# Altium schematic sheet pasta_razer_panthera_ps3_ps4.SchDoc
size Letter
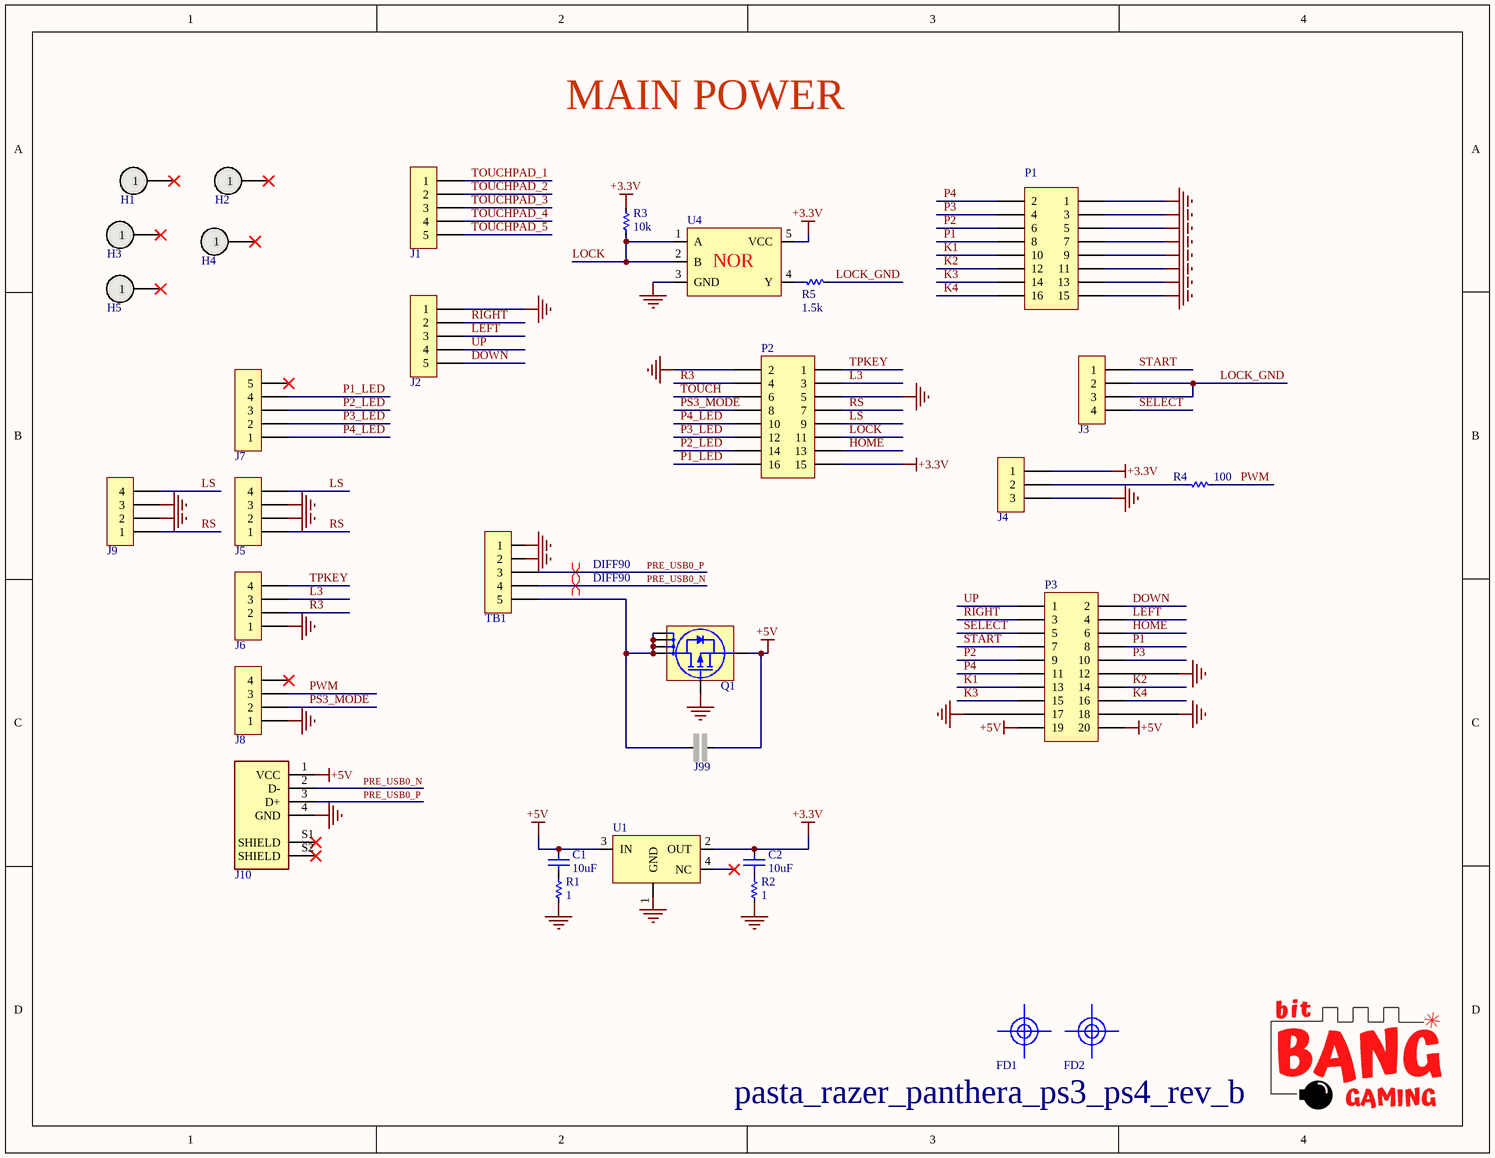
[diagram p0: pasta_razer_panthera_ps3_ps4.SchDoc]

## Parts
C1  10uF  [C1206]
C2  10uF  [C1206]
FD1  FIDUCIAL 60MIL CIRCLE  [FIDUCIAL-SQUARE-0.060]  (value not drawn)
FD2  FIDUCIAL 60MIL CIRCLE  [FIDUCIAL-SQUARE-0.060]  (value not drawn)
H1  M3  [STANDOFF-KEYSTONE-24882]  (value not drawn)
H2  M3  [STANDOFF-KEYSTONE-24882]  (value not drawn)
H3  M3  [STANDOFF-KEYSTONE-24882]  (value not drawn)
H4  M3  [STANDOFF-KEYSTONE-24882]  (value not drawn)
H5  M3  [STANDOFF-KEYSTONE-24882]  (value not drawn)
J1  B5B-XH-A(LF)(SN)  [CONN-JST-B5B-XH-A(LF)(SN)]  (value not drawn)
J2  B5B-XH-A(LF)(SN)  [CONN-JST-B5B-XH-A(LF)(SN)]  (value not drawn)
J3  B4B-XH-A(LF)(SN)  [CONN-JST-B4B-XH-A(LF)(SN)]  (value not drawn)
J4  B3B-XH-A(LF)(SN)  [CONN-JST-B3B-XH-A(LF)(SN)]  (value not drawn)
J5  S4B-PH-K-S(LF)(SN)  [CONN-JST-S4B-PH-K-S(LF)(SN)]  (value not drawn)
J6  S4B-PH-K-S(LF)(SN)  [CONN-JST-S4B-PH-K-S(LF)(SN)]  (value not drawn)
J7  S5B-PH-K-S(LF)(SN)  [CONN-JST-S5B-PH-K-S(LF)(SN)]  (value not drawn)
J8  S4B-PH-K-S(LF)(SN)  [CONN-JST-S4B-PH-K-S(LF)(SN)]  (value not drawn)
J9  M20-9990446  [CONN-1X4-HEADER-0.100-SIL]  (value not drawn)
J10  USB-A-S-S-W-TH  [CONN-USB-TYPE-A-FEMALE-RA]  (value not drawn)
J99  60 MIL SOLDER SHORT BRDIGE  [SOLDER-SHORT]  (value not drawn)  (no BOM)
P1  PH2-16-UA  [CONN-THRU-2X8-HEADER-0.100]  (value not drawn)
P2  PH2-16-UA  [CONN-THRU-2X8-HEADER-0.100]  (value not drawn)
P3  PH2-20-UA  [CONN-THRU-2X10-HEADER-0.100]  (value not drawn)
Q1  DMP3056LDM-7  [IC-SOT23-6]  (value not drawn)
R1  1  [r0603]
R2  1  [r0603]
R3  10k  [r0603]
R4  100  [r0603]
R5  1.5k  [r0603]
TB1  OSTVN05A150  [TB-5PIN-OST-OSTVN05A150]  (value not drawn)
U1  NCP1117LPST33T3G  [IC-SOT-223]  (value not drawn)
U4  SN74AHC1G02DBVT  [IC-SOT23-5]  (value not drawn)

## Nets
+3.3V: C2.2 J4.1 P2.15 R3.2 U1.2(OUT) U4.5(VCC)
+5V: C1.2 J10.1(VCC) J99.1 P3.19 P3.20 Q1.4(S) U1.3(IN)
GND: J2.1 J4.3 J5.2 J5.3 J6.1 J8.1 J9.2 J9.3 J10.4(GND) P1.1 P1.3 P1.5 P1.7 P1.9 P1.11 P1.13 P1.15 P2.2 P2.5 P3.12 P3.17 P3.18 Q1.3(G) R1.2 R2.2 TB1.1 TB1.2 U1.1(GND) U4.3(GND)
DOWN: J2.5 P3.2
HOME: P2.13 P3.6
K1: P1.10 P3.13
K2: P1.12 P3.14
K3: P1.14 P3.15
K4: P1.16 P3.16
L3: J6.3 P2.3
LEFT: J2.3 P3.4
LOCK: P2.11 R3.1 U4.1(A) U4.2(B)
LOCK_GND: J3.2 J3.3 R5.2
LS: J5.4 J9.4 P2.9
P1: P1.8 P3.8
P1_LED: J7.4 P2.16
P2: P1.6 P3.9
P2_LED: J7.3 P2.14
P3: P1.4 P3.10
P3_LED: J7.2 P2.12
P4: P1.2 P3.11
P4_LED: J7.1 P2.10
PRE_USB0_N: J10.2(D-) TB1.4
PRE_USB0_P: J10.3(D+) TB1.3
PS3_MODE: J8.2 P2.8
PWM: J8.3 R4.2
R3: J6.2 P2.4
RIGHT: J2.2 P3.3
RS: J5.1 J9.1 P2.7
SELECT: J3.4 P3.5
START: J3.1 P3.7
TOUCH: P2.6
TOUCHPAD_1: J1.1
TOUCHPAD_2: J1.2
TOUCHPAD_3: J1.3
TOUCHPAD_4: J1.4
TOUCHPAD_5: J1.5
TPKEY: J6.4 P2.1
UP: J2.4 P3.1
NetC1_1: C1.1 R1.1
NetC2_1: C2.1 R2.1
NetJ4_2: J4.2 R4.1
NetJ99_2: J99.2 Q1.1(D) Q1.2(D) Q1.5(D) Q1.6(D) TB1.5
NetR5_1: R5.1 U4.4(Y)

Not connected (* = marked no-connect by the designer): H1 1*; H2 1*; H3 1*; H4 1*; H5 1*; J7 5*; J8 4*; J10 S1(SHIELD)* S2(SHIELD)*; U1 4(NC)*

## Layout directives
differential pair; net class DIFF90: PRE_USB0_N, PRE_USB0_P

## Notes on the sheet
- MAIN POWER
- pasta_razer_panthera_ps3_ps4_rev_b
- (in symbol SN74AHC1G02DBVT) NOR

## Library data of the parts
C1 C2 = CL31B106KAHNFNE: CAP CER 10UF 25V X7R 1206; Manufacturer: Samsung Electro-Mechanics; Manufacturer Part Number: CL31B106KAHNFNE; Package / Case: 1206; Footprint Type: SMT
H1-H5 = 24882: ROUND STANDOFF M3 STEEL 3MM"; Manufacturer: Keystone Electronics; Manufacturer Part Number: 24882; Package / Case: M3; Footprint Type: SMT
J1 J2 = B5B-XH-A(LF)(SN): CONN HEADER VERT 5POS 2.5MM; Manufacturer: JST Sales America Inc.; Manufacturer Part Number: B5B-XH-A(LF)(SN); Package / Case: 5POS; Footprint Type: THT
J3 = B4B-XH-A(LF)(SN): CONN HEADER VERT 4POS 2.5MM; Manufacturer: JST Sales America Inc.; Manufacturer Part Number: B4B-XH-A(LF)(SN); Package / Case: 4POS; Footprint Type: THT
J4 = B3B-XH-A(LF)(SN): CONN HEADER VERT 3POS 2.5MM; Manufacturer: JST Sales America Inc.; Manufacturer Part Number: B3B-XH-A(LF)(SN); Package / Case: 3POS; Footprint Type: THT
J5 J6 J8 = S4B-PH-K-S(LF)(SN): CONN HEADER R/A 4POS 2MM; Manufacturer: JST Sales America Inc.; Manufacturer Part Number: S4B-PH-K-S(LF)(SN); Package / Case: 4POS; Footprint Type: THT
J7 = S5B-PH-K-S(LF)(SN): CONN HEADER R/A 5POS 2MM; Manufacturer: JST Sales America Inc.; Manufacturer Part Number: S5B-PH-K-S(LF)(SN); Package / Case: 5POS; Footprint Type: THT
J9 = M20-9990446: CONN HEADER VERT 4POS 2.54MM; Manufacturer: Harwin Inc.; Manufacturer Part Number: M20-9990446; Package / Case: 4POS; Footprint Type: THT
J10 = USB-A-S-S-W-TH: CONN RCPT USB2.0 TYPEA 4POS R/A; Manufacturer: Samtec; Footprint Type: THT; Manufacturer Part Number: USB-A-S-S-W-TH; Package / Case: USB TYPE A FEMALE
J99 = SOLDER BRIDGE
P1 P2 = PH2-16-UA: CONN HEADER VERT 16POS 2.54MM; Adam Tech: Manufacturer; THT: Footprint Type; Manufacturer Part Number: PH2-16-UA; Package / Case: 16POS
P3 = PH2-20-UA: CONN HEADER VERT 20POS 2.54MM; Manufacturer: Adam Tech; Manufacturer Part Number: PH2-20-UA; Package / Case: 20POS; Footprint Type: THT
Q1 = DMP3056LDM-7: MOSFET P-CH 30V 4.3A SOT-26; Manufacturer: Diodes Incorporated; Manufacturer Part Number: DMP3056LDM-7; Package / Case: SOT-23-6; Footprint Type: SMT
R1 R2 = CRCW06031R00FKEA: RES SMD 1 OHM 1% 1/10W 0603; Manufacturer: Vishay Dale; Manufacturer Part Number: CRCW06031R00FKEA; Footprint Type: SMT; Package / Case: 0603
R3 = CRCW060310K0FKEA: RES SMD 10K OHM 1% 1/10W 0603; Manufacturer: Vishay Dale; Manufacturer Part Number: CRCW060310K0FKEA; Package / Case: 0603; Footprint Type: SMT
R4 = CRCW0603100RFKEA: RES SMD 100 OHM 1% 1/10W 0603; Manufacturer: Vishay Dale; Manufacturer Part Number: CRCW0603100RFKEA; Package / Case: 0603; Footprint Type: SMT
R5 = CRCW06031K50FKEB: RES SMD 1.5K OHM 1% 1/10W 0603; Manufacturer: Vishay Dale; Manufacturer Part Number: CRCW06031K50FKEB; Package / Case: 0603; Footprint Type: SMT
TB1 = OSTVN05A150: TERM BLK 5P SIDE ENT 2.54MM PCB; Manufacturer: On Shore Technology Inc.; Manufacturer Part Number: OSTVN05A150; Package / Case: 5POS; Footprint Type: THT
U1 = NCP1117LPST33T3G: IC REG LINEAR 3.3V 1A SOT223; Manufacturer: onsemi; Manufacturer Part Number: NCP1117LPST33T3G; Package / Case: SOT-223; Footprint Type: SMT
U4 = SN74AHC1G02DBVT: IC GATE NOR 1CH 2-INP SOT23-5; Manufacturer: Texas Instruments; Manufacturer Part Number: SN74AHC1G02DBVT; Package / Case: SOT-23-5; Footprint Type: SMT